# Altium schematic sheet MOTOR.SchDoc: =ProjectName
size A4; CheckedBy: DatNB; Author: Ven; CompanyName: Nacentech; Organization: IMET
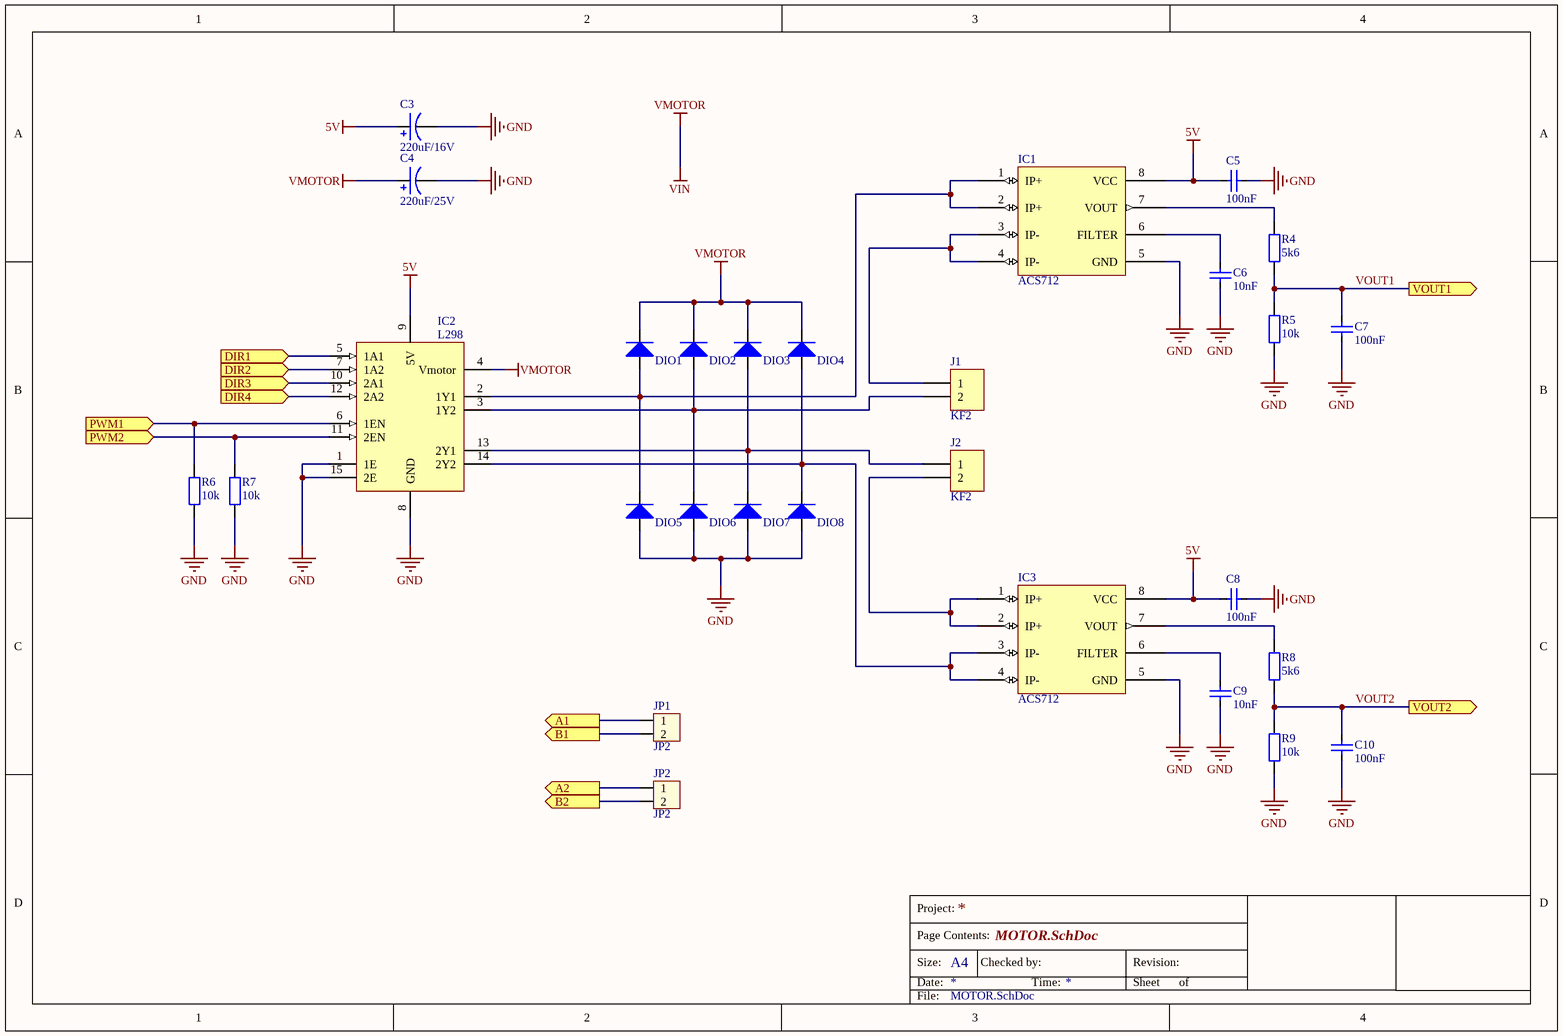
[diagram p0: MOTOR.SchDoc]

## Parts
C3  220uF/16V  [C8mm]
C4  220uF/25V  [C8mm]
C5  100nF  [CAP_0805]
C6  10nF  [CAP_0805]
C7  100nF  [CAP_0805]
C8  100nF  [CAP_0805]
C9  10nF  [CAP_0805]
C10  100nF  [CAP_0805]
DIO1  Diode SMD  [DIO-214AC(SMA)]  (value not drawn)
DIO2  Diode SMD  [DIO-214AC(SMA)]  (value not drawn)
DIO3  Diode SMD  [DIO-214AC(SMA)]  (value not drawn)
DIO4  Diode SMD  [DIO-214AC(SMA)]  (value not drawn)
DIO5  Diode SMD  [DIO-214AC(SMA)]  (value not drawn)
DIO6  Diode SMD  [DIO-214AC(SMA)]  (value not drawn)
DIO7  Diode SMD  [DIO-214AC(SMA)]  (value not drawn)
DIO8  Diode SMD  [DIO-214AC(SMA)]  (value not drawn)
IC1  ACS712  [SOIC-8]
IC2  L298  [DIP15SL2]
IC3  ACS712  [SOIC-8]
J1  KF2  [KF2-5.08]
J2  KF2  [KF2-5.08]
JP1  JP2  [CON2]
JP2  JP2  [CON2]
R4  5k6  [RES-SMD-0805]
R5  10k  [RES-SMD-0805]
R6  10k  [RES-SMD-0805]
R7  10k  [RES-SMD-0805]
R8  5k6  [RES-SMD-0805]
R9  10k  [RES-SMD-0805]

## Ports
A1 (out), A2 (out), B1 (out), B2 (out), DIR1 (in), DIR2 (in), DIR3 (in), DIR4 (in), PWM1 (in), PWM2 (in), VOUT1 (out), VOUT2 (out)

## Nets
5V: C3.1 C5.2 C8.2 IC1.8(VCC) IC2.9(5V) IC3.8(VCC)
GND: C3.2 C4.2 C5.1 C6.1 C7.1 C8.1 C9.1 C10.1 DIO5.1(A) DIO6.1(A) DIO7.1(A) DIO8.1(A) IC1.5(GND) IC2.1(1E) IC2.8(GND) IC2.15(2E) IC3.5(GND) R5.2 R6.2 R7.2 R9.2
VIN: C4.1 DIO1.2(K) DIO2.2(K) DIO3.2(K) DIO4.2(K) IC2.4(Vmotor)  [also labelled VMOTOR]
A1: JP1.1 ; port A1
A2: JP2.1 ; port A2
B1: JP1.2 ; port B1
B2: JP2.2 ; port B2
DIR1: IC2.5(1A1) ; port DIR1
DIR2: IC2.7(1A2) ; port DIR2
DIR3: IC2.10(2A1) ; port DIR3
DIR4: IC2.12(2A2) ; port DIR4
PWM1: IC2.6(1EN) R6.1 ; port PWM1
PWM2: IC2.11(2EN) R7.1 ; port PWM2
VOUT1: C7.2 R4.2 R5.1 ; port VOUT1
VOUT2: C10.2 R8.2 R9.1 ; port VOUT2
NetC6_2: C6.2 IC1.6(FILTER)
NetC9_2: C9.2 IC3.6(FILTER)
NetDIO1_1: DIO1.1(A) DIO5.2(K) IC1.1(IP+) IC1.2(IP+) IC2.2(1Y1)
NetDIO2_1: DIO2.1(A) DIO6.2(K) IC2.3(1Y2) J1.2
NetDIO3_1: DIO3.1(A) DIO7.2(K) IC2.13(2Y1) J2.1
NetDIO4_1: DIO4.1(A) DIO8.2(K) IC2.14(2Y2) IC3.3(IP-) IC3.4(IP-)
NetIC1_3: IC1.3(IP-) IC1.4(IP-) J1.1
NetIC1_7: IC1.7(VOUT) R4.1
NetIC3_1: IC3.1(IP+) IC3.2(IP+) J2.2
NetIC3_7: IC3.7(VOUT) R8.1

## Notes on the sheet
- Project:
- Page Contents:
- Size:
- Date:
- A4
- Checked by:
- Time:
- Revision:
- Sheet
- of
- File:

## Library data of the parts
C3 C4 = Cap Pol: Polarized Capacitor (Axial); Published: 8-Jun-2000; LatestRevisionDate: 17-Jul-2002; LatestRevisionNote: Re-released for DXP Platform.; PackageReference: POLAR0.8; Publisher: Altium Limited
C5-C10 = CapSMD: Capacitor; Value: 33p; Published: 8-Jun-2000; LatestRevisionDate: 17-Jul-2002; LatestRevisionNote: Re-released for DXP Platform.; PackageReference: RAD-0.3; Publisher: Altium Limited
DIO1-DIO8 = Diode SMD: Default Diode; Code - JEDEC: DO-214-AB; Value: 1N5007; Published: 8-Jun-2000; Revision: July-2002: Re-released for DXP Platform.; Publisher: Altium Limited
IC2 = L298: Dual Full-H Driver; Note: The tab is elec is connected to GND pin; Published: 15-May-2002; DatasheetVersion: Jun-1990; PackageReference: KV015; Publisher: Altium Limited; PackageDescription: TO, Thru-Hole, Vertical, Heatsink Mounted; 15 Bent Staggered Leads; Pitch 1.27 mm; ComponentLink1Description: Manufacturer Link; ComponentLink1URL: http://www.ti.com/
J1 J2 = KF2: Manufacturer: Würth Elektronik eiSos GmbH; partNo: 691103110002; ComponentLink1 Description: Manufacturer; ComponentLink2 Description: Datasheet; NoPins: 2; Created Date: 29 October 2013; ComponentLink1URL: http://www.we-online.com; ComponentLink2URL: http://katalog.we-online.de/em/datasheet/6911031100xx.pdf; Created by: Karrer Zheng
JP1 JP2 = Con2: Connector 2; Value: Connector 2
R4-R9 = Resistor - SMD: Resistor SMD; Manufacturer: Generic Components; Class: Passive; Published: 08/06/2000; Publisher: Altium Hobart Technology Centre